# Altium schematic sheet gate_driver.SchDoc
size A4; SheetNumber: 8; SheetTotal: 11
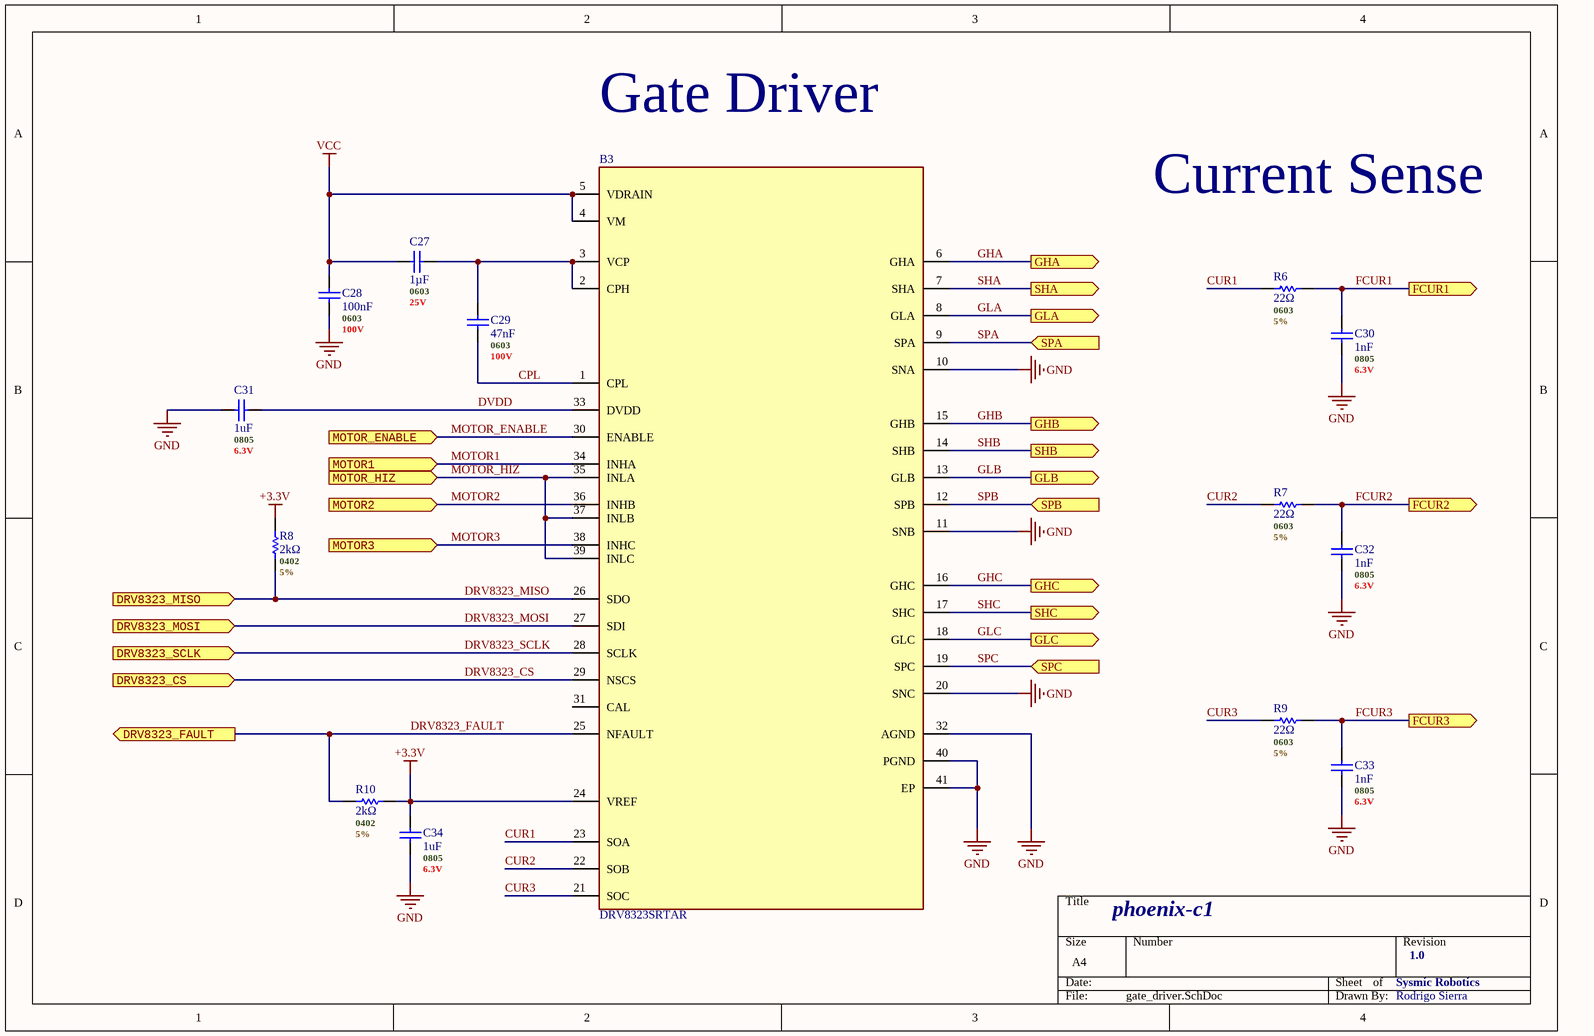
[diagram p0: gate_driver.SchDoc]

## Parts
B3  DRV8323SRTAR  [40-WQFN - TEXAS]
C27  1µF  .Case/Package: 0603  .Voltage Rating (DC): 25V  [C0603 - MURATA]
C28  100nF  .Case/Package: 0603  .Voltage Rating (DC): 100V  [C0603 - MURATA]
C29  47nF  .Case/Package: 0603  .Voltage Rating (DC): 100V  [C0603 - KEMET]
C30  1nF  .Case/Package: 0805  .Voltage Rating (DC): 6.3V  [C0805 - KYOCERA]
C31  1uF  .Case/Package: 0805  .Voltage Rating (DC): 6.3V  [C0805 - KYOCERA]
C32  1nF  .Case/Package: 0805  .Voltage Rating (DC): 6.3V  [C0805 - KYOCERA]
C33  1nF  .Case/Package: 0805  .Voltage Rating (DC): 6.3V  [C0805 - KYOCERA]
C34  1uF  .Case/Package: 0805  .Voltage Rating (DC): 6.3V  [C0805 - KYOCERA]
R6  22Ω  .Case/Package: 0603  .Tolerance: 5%  [R0603 - YAGEO]
R7  22Ω  .Case/Package: 0603  .Tolerance: 5%  [R0603 - YAGEO]
R8  2kΩ  .Case/Package: 0402  .Tolerance: 5%  [R0402 - YAGEO]
R9  22Ω  .Case/Package: 0603  .Tolerance: 5%  [R0603 - YAGEO]
R10  2kΩ  .Case/Package: 0402  .Tolerance: 5%  [R0402 - YAGEO]

## Ports
DRV8323_CS (in, see phoenix-c1-sch[3C], stm32g4[3C]), DRV8323_FAULT (out, see phoenix-c1-sch[3C], stm32g4[1C]), DRV8323_MISO (in, see phoenix-c1-sch[3B], stm32g4[3C]), DRV8323_MOSI (in, see phoenix-c1-sch[3C], stm32g4[3C]), DRV8323_SCLK (in, see phoenix-c1-sch[3C], stm32g4[3C]), FCUR1 (out, see phoenix-c1-sch[3C], stm32g4[3B]), FCUR2 (out, see phoenix-c1-sch[3C], stm32g4[3B]), FCUR3 (out, see phoenix-c1-sch[3C], stm32g4[3B]), GHA (out, see phoenix-c1-sch[4B], hbridgeA[1B]), GHB (out, see phoenix-c1-sch[4C], hbridgeB[1B]), GHC (out, see phoenix-c1-sch[4C], hbridgeC[1B]), GLA (out, see phoenix-c1-sch[4B], hbridgeA[1C]), GLB (out, see phoenix-c1-sch[4C], hbridgeB[1C]), GLC (out, see phoenix-c1-sch[4C], hbridgeC[1C]), MOTOR1 (in, see phoenix-c1-sch[3B], stm32g4[3B]), MOTOR2 (in, see phoenix-c1-sch[3B], stm32g4[3B]), MOTOR3 (in, see phoenix-c1-sch[3B], stm32g4[3B]), MOTOR_ENABLE (in, see phoenix-c1-sch[3B], stm32g4[1C]), MOTOR_HIZ (in, see phoenix-c1-sch[3B], stm32g4[1C]), SHA (out, see phoenix-c1-sch[4B], hbridgeA[1B]), SHB (out, see phoenix-c1-sch[4C], hbridgeB[1B]), SHC (out, see phoenix-c1-sch[4C], hbridgeC[1B]), SPA (in, see phoenix-c1-sch[4B], hbridgeA[2C]), SPB (in, see phoenix-c1-sch[4C], hbridgeB[2D]), SPC (in, see phoenix-c1-sch[4C], hbridgeC[2D])

## Nets
+3.3V: B3.24(VREF) C34.2 R8.1 R10.2
GND: B3.10(SNA) B3.11(SNB) B3.20(SNC) B3.32(AGND) B3.40(PGND) B3.41(EP) C28.1 C30.1 C31.1 C32.1 C33.1 C34.1
VCC: B3.4(VM) B3.5(VDRAIN) C27.1 C28.2
CPL: B3.1(CPL) C29.1
CUR1: B3.23(SOA) R6.1
CUR2: B3.22(SOB) R7.1
CUR3: B3.21(SOC) R9.1
DRV8323_CS: B3.29(NSCS) ; port DRV8323_CS
DRV8323_FAULT: B3.25(NFAULT) R10.1 ; port DRV8323_FAULT
DRV8323_MISO: B3.26(SDO) R8.2 ; port DRV8323_MISO
DRV8323_MOSI: B3.27(SDI) ; port DRV8323_MOSI
DRV8323_SCLK: B3.28(SCLK) ; port DRV8323_SCLK
DVDD: B3.33(DVDD) C31.2
FCUR1: C30.2 R6.2 ; port FCUR1
FCUR2: C32.2 R7.2 ; port FCUR2
FCUR3: C33.2 R9.2 ; port FCUR3
GHA: B3.6(GHA) ; port GHA
GHB: B3.15(GHB) ; port GHB
GHC: B3.16(GHC) ; port GHC
GLA: B3.8(GLA) ; port GLA
GLB: B3.13(GLB) ; port GLB
GLC: B3.18(GLC) ; port GLC
MOTOR1: B3.34(INHA) ; port MOTOR1
MOTOR2: B3.36(INHB) ; port MOTOR2
MOTOR3: B3.38(INHC) ; port MOTOR3
MOTOR_ENABLE: B3.30(ENABLE) ; port MOTOR_ENABLE
MOTOR_HIZ: B3.35(INLA) B3.37(INLB) B3.39(INLC) ; port MOTOR_HIZ
SHA: B3.7(SHA) ; port SHA
SHB: B3.14(SHB) ; port SHB
SHC: B3.17(SHC) ; port SHC
SPA: B3.9(SPA) ; port SPA
SPB: B3.12(SPB) ; port SPB
SPC: B3.19(SPC) ; port SPC
NetB3_2: B3.2(CPH) B3.3(VCP) C27.2 C29.2

Not connected (* = marked no-connect by the designer): B3 31(CAL)

## Notes on the sheet
- Gate Driver
- Current Sense
- phoenix-c1
- Sysmic Robotics
- 1.0
- Rodrigo Sierra

## Library data of the parts
B3 = DRV8323SRTAR: Gate Drivers 60V Three-Phase Smart Gate Driver With Three Current Shunt Amplifiers 40-WQFN -40 to 125; Manufacturer_Name: Texas Instruments; Geometry.Height: 0.8mm; Mouser Part Number: 595-DRV8323SRTAR; Mouser Price/Stock: https://www.mouser.co.uk/ProductDetail/Texas-Instruments/DRV8323SRTAR?qs=u4fy%2FsgLU9P2gpPTX6mffg%3D%3D; Manufacturer_Part_Number: DRV8323SRTAR; Datasheet Link: http://www.ti.com/lit/ds/symlink/drv8323.pdf; Supplier 1: Mouser; Supplier Part Number 1: 595-DRV8323SRTAR
C27 = C1608X7R1E105K080AE: 25V 1uF X7R 卤10% 0603 Multilayer Ceramic Capacitors MLCC - SMD/SMT ROHS; Manufacturer: TDK; Manufacturer Lifecycle Status: PRODUCTION; Tolerance: 10%; Supplier: Mouser; Supplier Part Number: 810-C1608X7R1E105KAE; Manufacturer Part Number: C1608X7R1E105K080AE; RoHS: Compliant; Category: Ceramic Capacitors; Stock: 89352; Pricing: 1=0,24, 10=0,1, 50=0,1, 100=0,088, 1000=0,062, 10000=0,044 (USD); Value: 1µF; Case/Package: 0603; Case Code (Imperial): 0603; Case Code (Metric): 1608; China RoHS: Compliant; Dielectric Material: Ceramic; Features: Soft Termination; Height: 800µm; Length: 1.6mm; Lifecycle Status: Production; Material: Ceramic; Max Length: 1.8mm; Max Operating Temperature: 125°C; Max Width: 950µm; Min Length: 1.5mm; Min Operating Temperature: -55°C; Min Width: 700µm; Mounting Technology: Surface Mount; Number of Terminals: 2; REACH SVHC: Yes; Schedule B: 8532240020, 8532240020|8532240020|8532240020|8532240020|8532240020; Thickness: 939.8µm; Voltage Rating: 25V; Voltage Rating (DC): 25V; Width: 800µm; ComponentLink1URL: https://datasheet.octopart.com:443/C1608X7R1E105K080AE-TDK-datasheet-182135025.pdf?src-supplier=TME; ComponentLink1Description: https://datasheet.octopart.com:443/C1608X7R1E105K080AE-TDK-datasheet-182135025.pdf?src-supplier=TME; ComponentLink2URL: https://datasheet.octopart.com:443/C1608X7R1E105K080AE-TDK-datasheet-159617022.pdf?src-supplier=TME; ComponentLink2Description: https://datasheet.octopart.com:443/C1608X7R1E105K080AE-TDK-datasheet-159617022.pdf?src-supplier=TME; ComponentLink3URL: https://datasheet.octopart.com:443/C1608X7R1E105K080AE-TDK-datasheet-151546525.pdf?src-supplier=ODG+(Origin+Data+Global); ComponentLink3Description: https://datasheet.octopart.com:443/C1608X7R1E105K080AE-TDK-datasheet-151546525.pdf?src-supplier=ODG+(Origin+Data+Global); ComponentLink4URL: https://datasheet.octopart.com:443/C1608X7R1E105K080AE-TDK-datasheet-60278151.pdf?src-supplier=Future+Electronics; ComponentLink4Description: https://datasheet.octopart.com:443/C1608X7R1E105K080AE-TDK-datasheet-60278151.pdf?src-supplier=Future+Electronics; Supplier 1: Mouser; Supplier Part Number 1: 810-C1608X7R1E105KAE
C28 = GCJ188R72A104KA01D: Cap Ceramic 0.1uF 100V X7R 10% Pad SMD 0603 Soft Termination 125C Automotive T/R; Manufacturer: Murata; Manufacturer Lifecycle Status: IN PRODUCTION; Supplier: Avnet; Supplier Part Number: GCJ188R72A104KA01D; Manufacturer Part Number: GCJ188R72A104KA01D; RoHS: Compliant; Category: Ceramic Capacitors; Stock: 848000; Pricing: 4000=0,02065 (USD); Value: 100nF; Case/Package: 0603; Case Code (Imperial): 0603; Case Code (Metric): 1608; Dielectric Material: Ceramic; Features: Soft Termination; Height: 800µm; Lead Free: Lead Free; Length: 1.6mm; Lifecycle Status: Production; Material: Ceramic; Max Operating Temperature: 125°C; Min Operating Temperature: -55°C; Mounting Technology: Surface Mount; Number of Terminals: 2; Ratings: AEC-Q200; REACH SVHC: Yes; Schedule B: 8532240020, 8532240020|8532240020, 8532240020|8532240020|8532240020, 8532240020|8532240020|8532240020|8532240020; Tolerance: 10%; Voltage Rating: 100V; Voltage Rating (DC): 100V; Width: 800µm; ComponentLink1URL: https://datasheet.octopart.com:443/GCJ188R72A104KA01D-Murata-datasheet-141264712.pdf?src-supplier=Geoflip; ComponentLink1Description: https://datasheet.octopart.com:443/GCJ188R72A104KA01D-Murata-datasheet-141264712.pdf?src-supplier=Geoflip; ComponentLink2URL: https://datasheet.octopart.com:443/GCJ188R72A104KA01D-Murata-datasheet-140654819.pdf?src-supplier=Ciiva; ComponentLink2Description: https://datasheet.octopart.com:443/GCJ188R72A104KA01D-Murata-datasheet-140654819.pdf?src-supplier=Ciiva; ComponentLink3URL: https://datasheet.octopart.com:443/GCJ188R72A104KA01D-Murata-datasheet-138714490.pdf?src-supplier=Ciiva; ComponentLink3Description: https://datasheet.octopart.com:443/GCJ188R72A104KA01D-Murata-datasheet-138714490.pdf?src-supplier=Ciiva; ComponentLink4URL: https://datasheet.octopart.com:443/GCJ188R72A104KA01D-Murata-datasheet-165611796.pdf?src-supplier=TME; ComponentLink4Description: https://datasheet.octopart.com:443/GCJ188R72A104KA01D-Murata-datasheet-165611796.pdf?src-supplier=TME; ComponentLink5URL: https://datasheet.octopart.com:443/GCJ188R72A104KA01D-Murata-datasheet-128592638.pdf?src-supplier=X-ON; ComponentLink5Description: https://datasheet.octopart.com:443/GCJ188R72A104KA01D-Murata-datasheet-128592638.pdf?src-supplier=X-ON; ComponentLink6URL: https://datasheet.octopart.com:443/GCJ188R72A104KA01D-Murata-datasheet-78375067.pdf?src-supplier=Future+Electronics; ComponentLink6Description: https://datasheet.octopart.com:443/GCJ188R72A104KA01D-Murata-datasheet-78375067.pdf?src-supplier=Future+Electronics; ComponentLink7URL: https://datasheet.octopart.com:443/GCJ188R72A104KA01D-Murata-datasheet-12532847.pdf?src-supplier=Future+Electronics; ComponentLink7Description: https://datasheet.octopart.com:443/GCJ188R72A104KA01D-Murata-datasheet-12532847.pdf?src-supplier=Future+Electronics; ComponentLink8URL: http://sigma.octopart.com:80/reach_statement/Murata-company-16.pdf?src-supplier=Compliance+Statements; ComponentLink8Description: http://sigma.octopart.com:80/reach_statement/Murata-company-16.pdf?src-supplier=Compliance+Statements; Supplier 1: Mouser; Supplier Part Number 1: 81-GCJ188R72A104KA1D
C29 = C0603X473K1RACTU: Multilayer Ceramic Capacitors MLCC - SMD/SMT 100V 0.047uF X7R 0603 10% Flex Soft; Manufacturer: KEMET; Supplier: Mouser; Supplier Part Number: 80-C0603X473K1R; Manufacturer Part Number: C0603X473K1RACTU; RoHS: Compliant; Category: Ceramic Capacitors; Stock: 189; Pricing: 1=0,44, 10=0,198, 50=0,198, 100=0,162, 1000=0,131, 10000=0,101 (USD); Value: 47nF; Case/Package: 0603; Case Code (Imperial): 0603; Case Code (Metric): 1608; China RoHS: Compliant; Depth: 800µm; Dielectric: X7R; Dielectric Material: Ceramic; Features: Soft Termination; Height: 800µm; Length: 1.6mm; Lifecycle Status: Production; Max Operating Temperature: 125°C; Min Operating Temperature: -55°C; Mounting Technology: Surface Mount; Number of Terminals: 2; Packaging: Tape and Reel; REACH SVHC: Yes; Termination: SMD/SMT; Thickness: 863.6µm; Tolerance: 10%; Voltage Rating: 100V; Voltage Rating (DC): 100V; Width: 800µm; ComponentLink1URL: https://datasheet.octopart.com:443/C0603X473K1RACTU-KEMET-datasheet-182040354.pdf?src-supplier=IHS; ComponentLink1Description: https://datasheet.octopart.com:443/C0603X473K1RACTU-KEMET-datasheet-182040354.pdf?src-supplier=IHS; ComponentLink2URL: https://datasheet.octopart.com:443/C0603X473K1RACTU-KEMET-datasheet-149523211.pdf?src-supplier=Farnell; ComponentLink2Description: https://datasheet.octopart.com:443/C0603X473K1RACTU-KEMET-datasheet-149523211.pdf?src-supplier=Farnell; ComponentLink3URL: https://datasheet.octopart.com:443/C0603X473K1RACTU-KEMET-datasheet-182910228.pdf?src-supplier=Farnell; ComponentLink3Description: https://datasheet.octopart.com:443/C0603X473K1RACTU-KEMET-datasheet-182910228.pdf?src-supplier=Farnell; ComponentLink4URL: https://datasheet.octopart.com:443/C0603X473K1RACTU-KEMET-datasheet-158079525.pdf?src-supplier=Electro+Sonic; ComponentLink4Description: https://datasheet.octopart.com:443/C0603X473K1RACTU-KEMET-datasheet-158079525.pdf?src-supplier=Electro+Sonic; ComponentLink5URL: https://datasheet.octopart.com:443/C0603X473K1RACTU-KEMET-datasheet-189885820.pdf?src-supplier=element14+APAC; ComponentLink5Description: https://datasheet.octopart.com:443/C0603X473K1RACTU-KEMET-datasheet-189885820.pdf?src-supplier=element14+APAC; ComponentLink6URL: https://datasheet.octopart.com/C0603X473K1RACTU-KEMET-datasheet-84169754.pdf; ComponentLink6Description: https://datasheet.octopart.com/C0603X473K1RACTU-KEMET-datasheet-84169754.pdf; ComponentLink7URL: https://datasheet.octopart.com:443/C0603X473K1RACTU-KEMET-datasheet-182857673.pdf?src-supplier=Newark; ComponentLink7Description: https://datasheet.octopart.com:443/C0603X473K1RACTU-KEMET-datasheet-182857673.pdf?src-supplier=Newark; Supplier 1: Mouser; Supplier Part Number 1: 80-C0603X473K1R
C30 C32 C33 = 08056C102JAT2A: Multilayer Ceramic Capacitors MLCC - SMD/SMT 6.3V 1000pF X7R 0805 5%; Manufacturer: KYOCERA AVX; Supplier: Mouser; Supplier Part Number: 581-08056C102JAT2A; Manufacturer Part Number: 08056C102JAT2A; RoHS: Compliant; Category: Ceramic Capacitors; Stock: 11081; Pricing: 1=0,26, 10=0,167, 50=0,167, 100=0,099, 1000=0,072, 10000=0,057 (USD); Value: 1nF; Case/Package: 0805; Case Code (Imperial): 0805; Case Code (Metric): 2012; Depth: 1.25mm; Dielectric: X7R; Dissipation Factor: 5%; Length: 2.01mm; Max Operating Temperature: 125°C; Min Operating Temperature: -55°C; Mounting Technology: Surface Mount; Termination: SMD/SMT; Thickness: 939.8µm; Tolerance: 5%; Voltage Rating: 6.3V; Voltage Rating (DC): 6.3V; Width: 1.2446mm; ComponentLink1URL: https://datasheet.octopart.com/08056C102JAT2A-KYOCERA-AVX-datasheet-13516023.pdf; ComponentLink1Description: https://datasheet.octopart.com/08056C102JAT2A-KYOCERA-AVX-datasheet-13516023.pdf; ComponentLink2URL: http://sigma.octopart.com:80/reach_statement/AVX-company-19.pdf?src-supplier=Compliance+Statements; ComponentLink2Description: http://sigma.octopart.com:80/reach_statement/AVX-company-19.pdf?src-supplier=Compliance+Statements; ComponentLink3URL: http://sigma.octopart.com:80/conflict_mineral_statement/AVX-company-34.pdf?src-supplier=Compliance+Statements; ComponentLink3Description: http://sigma.octopart.com:80/conflict_mineral_statement/AVX-company-34.pdf?src-supplier=Compliance+Statements; Supplier 1: Mouser; Supplier Part Number 1: 581-08056C102JAT2A
C31 C34 = 08056C105MAT2A: Multilayer Ceramic Capacitors MLCC - SMD/SMT 6.3V 1uF X7R 0805 20%; Manufacturer: KYOCERA AVX; Manufacturer Part Number: 08056C102JAT2A; Dissipation Factor: 5%; Supplier: Mouser; Supplier Part Number: 581-08056C102JAT2A; RoHS: Compliant; Category: Ceramic Capacitors; Stock: 11081; Pricing: 1=0,26, 10=0,167, 50=0,167, 100=0,099, 1000=0,072, 10000=0,057 (USD); Value: 1uF; Case/Package: 0805; Case Code (Imperial): 0805; Case Code (Metric): 2012; Depth: 1.25mm; Dielectric: X7R; Length: 2.01mm; Max Operating Temperature: 125°C; Min Operating Temperature: -55°C; Mounting Technology: Surface Mount; Termination: SMD/SMT; Thickness: 939.8µm; Tolerance: 5%; Voltage Rating: 6.3V; Voltage Rating (DC): 6.3V; Width: 1.2446mm; ComponentLink1URL: https://datasheet.octopart.com/08056C102JAT2A-KYOCERA-AVX-datasheet-13516023.pdf; ComponentLink1Description: https://datasheet.octopart.com/08056C102JAT2A-KYOCERA-AVX-datasheet-13516023.pdf; ComponentLink2URL: http://sigma.octopart.com:80/reach_statement/AVX-company-19.pdf?src-supplier=Compliance+Statements; ComponentLink2Description: http://sigma.octopart.com:80/reach_statement/AVX-company-19.pdf?src-supplier=Compliance+Statements; ComponentLink3URL: http://sigma.octopart.com:80/conflict_mineral_statement/AVX-company-34.pdf?src-supplier=Compliance+Statements; ComponentLink3Description: http://sigma.octopart.com:80/conflict_mineral_statement/AVX-company-34.pdf?src-supplier=Compliance+Statements; Pins: 2; Packaging: Tape & Reel; Radiation Hardening: No; ComponentLink4URL: https://datasheet.octopart.com:443/08056C105MAT2A-AVX-datasheet-78690206.pdf?src-supplier=Newark; ComponentLink4Description: https://datasheet.octopart.com:443/08056C105MAT2A-AVX-datasheet-78690206.pdf?src-supplier=Newark; ComponentLink5URL: https://datasheet.octopart.com:443/08056C105MAT2A-AVX-datasheet-8447489.pdf?src-supplier=Newark; ComponentLink5Description: https://datasheet.octopart.com:443/08056C105MAT2A-AVX-datasheet-8447489.pdf?src-supplier=Newark; ComponentLink6URL: https://datasheet.octopart.com/08056C105MAT2A-KYOCERA-AVX-datasheet-13516023.pdf; ComponentLink6Description: https://datasheet.octopart.com/08056C105MAT2A-KYOCERA-AVX-datasheet-13516023.pdf; Supplier 1: Mouser; Supplier Part Number 1: 581-08056C105MAT2A
R6 R7 R9 = RC0603JR-0722RL: 100Mw Thick Film Resistors 100Ppm/ 5% 22 0603 Chip Resistor Surface Mount Rohs; Manufacturer: Yageo Group; Temperature Coefficient: 100ppm/°C; Voltage Rating: 50V; Working Voltage: 75V; Supplier: Mouser; Supplier Part Number: 603-RC0603JR-0722RL; Manufacturer Part Number: RC0603JR-0722RL; RoHS: Compliant; Category: Chip SMD Resistors; Stock: 2700649; Pricing: 1=0,1, 10=0,005, 50=0,005, 100=0,005, 1000=0,005, 10000=0,001 (USD); Case/Package: 0603; Case Code (Imperial): 0603; China RoHS: Non-Compliant; Composition: Thick Film; Depth: 800µm; Height: 450µm; Lead Free: Lead Free; Length: 1.6mm; Lifecycle Status: Production; Max Operating Temperature: 155°C; Military Standard: Not; Min Operating Temperature: -55°C; Mounting Technology: Surface Mount; Pins: 2; Number of Terminals: 2; Packaging: Tape & Reel; Power Dissipation: 100mW; Power Rating: 100mW; REACH SVHC: Yes; Schedule B: 8533210045, 8533210045|8533210045, 8533210045|8533210045|8533210045, 8533210045|8533210045|8533210045|8533210045; Termination: SMD/SMT; Tolerance: 5%; Voltage Rating (AC): 50V; Voltage Rating (DC): 50V; Width: 800µm; ComponentLink1URL: https://datasheet.octopart.com:443/RC0603JR-0722RL-Yageo-datasheet-175887523.pdf?src-supplier=Newark; ComponentLink1Description: https://datasheet.octopart.com:443/RC0603JR-0722RL-Yageo-datasheet-175887523.pdf?src-supplier=Newark; ComponentLink2URL: https://datasheet.octopart.com:443/RC0603JR-0722RL-Yageo-datasheet-8328172.pdf?src-supplier=Newark; ComponentLink2Description: https://datasheet.octopart.com:443/RC0603JR-0722RL-Yageo-datasheet-8328172.pdf?src-supplier=Newark; ComponentLink3URL: https://datasheet.octopart.com:443/RC0603JR-0722RL-Yageo-datasheet-34211833.pdf?src-supplier=Newark; ComponentLink3Description: https://datasheet.octopart.com:443/RC0603JR-0722RL-Yageo-datasheet-34211833.pdf?src-supplier=Newark; ComponentLink4URL: https://datasheet.octopart.com:443/RC0603JR-0722RL-Yageo-datasheet-62067350.pdf?src-supplier=element14+APAC; ComponentLink4Description: https://datasheet.octopart.com:443/RC0603JR-0722RL-Yageo-datasheet-62067350.pdf?src-supplier=element14+APAC; ComponentLink5URL: https://datasheet.octopart.com:443/RC0603JR-0722RL-Yageo-datasheet-15599030.pdf?src-supplier=Seeed+Studio; ComponentLink5Description: https://datasheet.octopart.com:443/RC0603JR-0722RL-Yageo-datasheet-15599030.pdf?src-supplier=Seeed+Studio; ComponentLink6URL: https://datasheet.octopart.com:443/RC0603JR-0722RL-Yageo-Group-datasheet-176638170.pdf?src-supplier=Farnell; ComponentLink6Description: https://datasheet.octopart.com:443/RC0603JR-0722RL-Yageo-Group-datasheet-176638170.pdf?src-supplier=Farnell; ComponentLink7URL: https://datasheet.octopart.com:443/RC0603JR-0722RL-Yageo-datasheet-164759695.pdf?src-supplier=Future+Electronics; ComponentLink7Description: https://datasheet.octopart.com:443/RC0603JR-0722RL-Yageo-datasheet-164759695.pdf?src-supplier=Future+Electronics; ComponentLink8URL: https://datasheet.octopart.com:443/RC0603JR-0722RL-Yageo-datasheet-137700087.pdf?src-supplier=Future+Electronics; ComponentLink8Description: https://datasheet.octopart.com:443/RC0603JR-0722RL-Yageo-datasheet-137700087.pdf?src-supplier=Future+Electronics; ComponentLink9URL: https://datasheet.octopart.com:443/RC0603JR0722RL-Yageo-datasheet-27584510.pdf?src-supplier=Future+Electronics; ComponentLink9Description: https://datasheet.octopart.com:443/RC0603JR0722RL-Yageo-datasheet-27584510.pdf?src-supplier=Future+Electronics; ComponentLink10URL: https://datasheet.octopart.com:443/RC0603JR-0722RL-Yageo-datasheet-12596169.pdf?src-supplier=Future+Electronics; ComponentLink10Description: https://datasheet.octopart.com:443/RC0603JR-0722RL-Yageo-datasheet-12596169.pdf?src-supplier=Future+Electronics; ComponentLink11URL: https://datasheet.octopart.com:443/RC0603JR-0722RL-Yageo-datasheet-8324193.pdf?src-supplier=Future+Electronics; ComponentLink11Description: https://datasheet.octopart.com:443/RC0603JR-0722RL-Yageo-datasheet-8324193.pdf?src-supplier=Future+Electronics; ComponentLink12URL: https://datasheet.octopart.com/RC0603JR-0722RL-Yageo-datasheet-73766026.pdf; ComponentLink12Description: https://datasheet.octopart.com/RC0603JR-0722RL-Yageo-datasheet-73766026.pdf; ComponentLink13URL: https://datasheet.octopart.com:443/RC0603JR-0722RL-Yageo-datasheet-118562.pdf?src-supplier=DigiKey; ComponentLink13Description: https://datasheet.octopart.com:443/RC0603JR-0722RL-Yageo-datasheet-118562.pdf?src-supplier=DigiKey; ComponentLink14URL: http://sigma.octopart.com:80/conflict_mineral_statement/Yageo-company-3.pdf?src-supplier=Compliance+Statements; ComponentLink14Description: http://sigma.octopart.com:80/conflict_mineral_statement/Yageo-company-3.pdf?src-supplier=Compliance+Statements; ComponentLink15URL: http://sigma.octopart.com:80/rohs_statement/Yageo-company-2.pdf?src-supplier=Compliance+Statements; ComponentLink15Description: http://sigma.octopart.com:80/rohs_statement/Yageo-company-2.pdf?src-supplier=Compliance+Statements; Supplier 1: Mouser; Supplier Part Number 1: 603-RC0603JR-0722RL; Value: 22Ω
R8 R10 = AF0402JR-072KL: Anti-Sulfurated Chip Resistor Thick Film 0402 2kOhm 5% Paper T/R; Manufacturer: Yageo Group; Max Power Dissipation: 63mW; Power Dissipation: 62.5mW; Temperature Coefficient: 100ppm/°C; Voltage Rating: 50V; Supplier: Mouser; Supplier Part Number: 603-AF0402JR-072KL; Manufacturer Part Number: AF0402JR-072KL; RoHS: Compliant; Category: Chip SMD Resistors; Stock: 66785; Pricing: 1=0,1, 10=0,007, 50=0,007, 100=0,006, 1000=0,005, 10000=0,005 (USD); Case/Package: 0402; China RoHS: Non-Compliant; Composition: Thick Film; Features: Anti-Sulfur, Moisture Resistant; Height: 350µm; Length: 990.6µm; Lifecycle Status: Production; Max Operating Temperature: 155°C; Min Operating Temperature: -55°C; Mounting Technology: Surface Mount; Number of Terminals: 2; Number of Terminations: 2; Packaging: Tape & Reel; Power Rating: 62.5mW; REACH SVHC: Yes; Value: 2kΩ; Tolerance: 5%; Width: 500µm; Working Voltage: 50V; ComponentLink1URL: https://datasheet.octopart.com:443/AF0402JR-072KL-Yageo-datasheet-182189395.pdf?src-supplier=IHS; ComponentLink1Description: https://datasheet.octopart.com:443/AF0402JR-072KL-Yageo-datasheet-182189395.pdf?src-supplier=IHS; ComponentLink2URL: https://datasheet.octopart.com:443/AF0402JR-072KL-Yageo-datasheet-153645569.pdf?src-supplier=Upverter; ComponentLink2Description: https://datasheet.octopart.com:443/AF0402JR-072KL-Yageo-datasheet-153645569.pdf?src-supplier=Upverter; ComponentLink3URL: https://sigma.octopart.com:443/138820526/technical_drawing/Yageo-AF0402JR-072KL.pdf?src-supplier=Upverter; ComponentLink3Description: https://sigma.octopart.com:443/138820526/technical_drawing/Yageo-AF0402JR-072KL.pdf?src-supplier=Upverter; ComponentLink4URL: https://datasheet.octopart.com/AF0402JR-072KL-Yageo-datasheet-68296209.pdf; ComponentLink4Description: https://datasheet.octopart.com/AF0402JR-072KL-Yageo-datasheet-68296209.pdf; ComponentLink5URL: https://datasheet.octopart.com:443/AF0402JR-072KL-Yageo-datasheet-164730775.pdf?src-supplier=Future+Electronics; ComponentLink5Description: https://datasheet.octopart.com:443/AF0402JR-072KL-Yageo-datasheet-164730775.pdf?src-supplier=Future+Electronics; ComponentLink6URL: https://datasheet.octopart.com:443/AF0402JR-072KL-Yageo-datasheet-137481464.pdf?src-supplier=Future+Electronics; ComponentLink6Description: https://datasheet.octopart.com:443/AF0402JR-072KL-Yageo-datasheet-137481464.pdf?src-supplier=Future+Electronics; ComponentLink7URL: https://datasheet.octopart.com:443/AF0402JR-072KL-Yageo-datasheet-27714391.pdf?src-supplier=Future+Electronics; ComponentLink7Description: https://datasheet.octopart.com:443/AF0402JR-072KL-Yageo-datasheet-27714391.pdf?src-supplier=Future+Electronics; ComponentLink8URL: http://sigma.octopart.com:80/rohs_statement/Yageo-company-2.pdf?src-supplier=Compliance+Statements; ComponentLink8Description: http://sigma.octopart.com:80/rohs_statement/Yageo-company-2.pdf?src-supplier=Compliance+Statements; ComponentLink9URL: http://sigma.octopart.com:80/conflict_mineral_statement/Yageo-company-3.pdf?src-supplier=Compliance+Statements; ComponentLink9Description: http://sigma.octopart.com:80/conflict_mineral_statement/Yageo-company-3.pdf?src-supplier=Compliance+Statements; Supplier 1: Mouser; Supplier Part Number 1: 603-AF0402JR-072KL